# Altium schematic sheet featherULP.SchDoc
size 282 x 200 mm; COMPANY: ADAFRUIT INDUSTRIES; DRAWN: KTOWN; REV: B
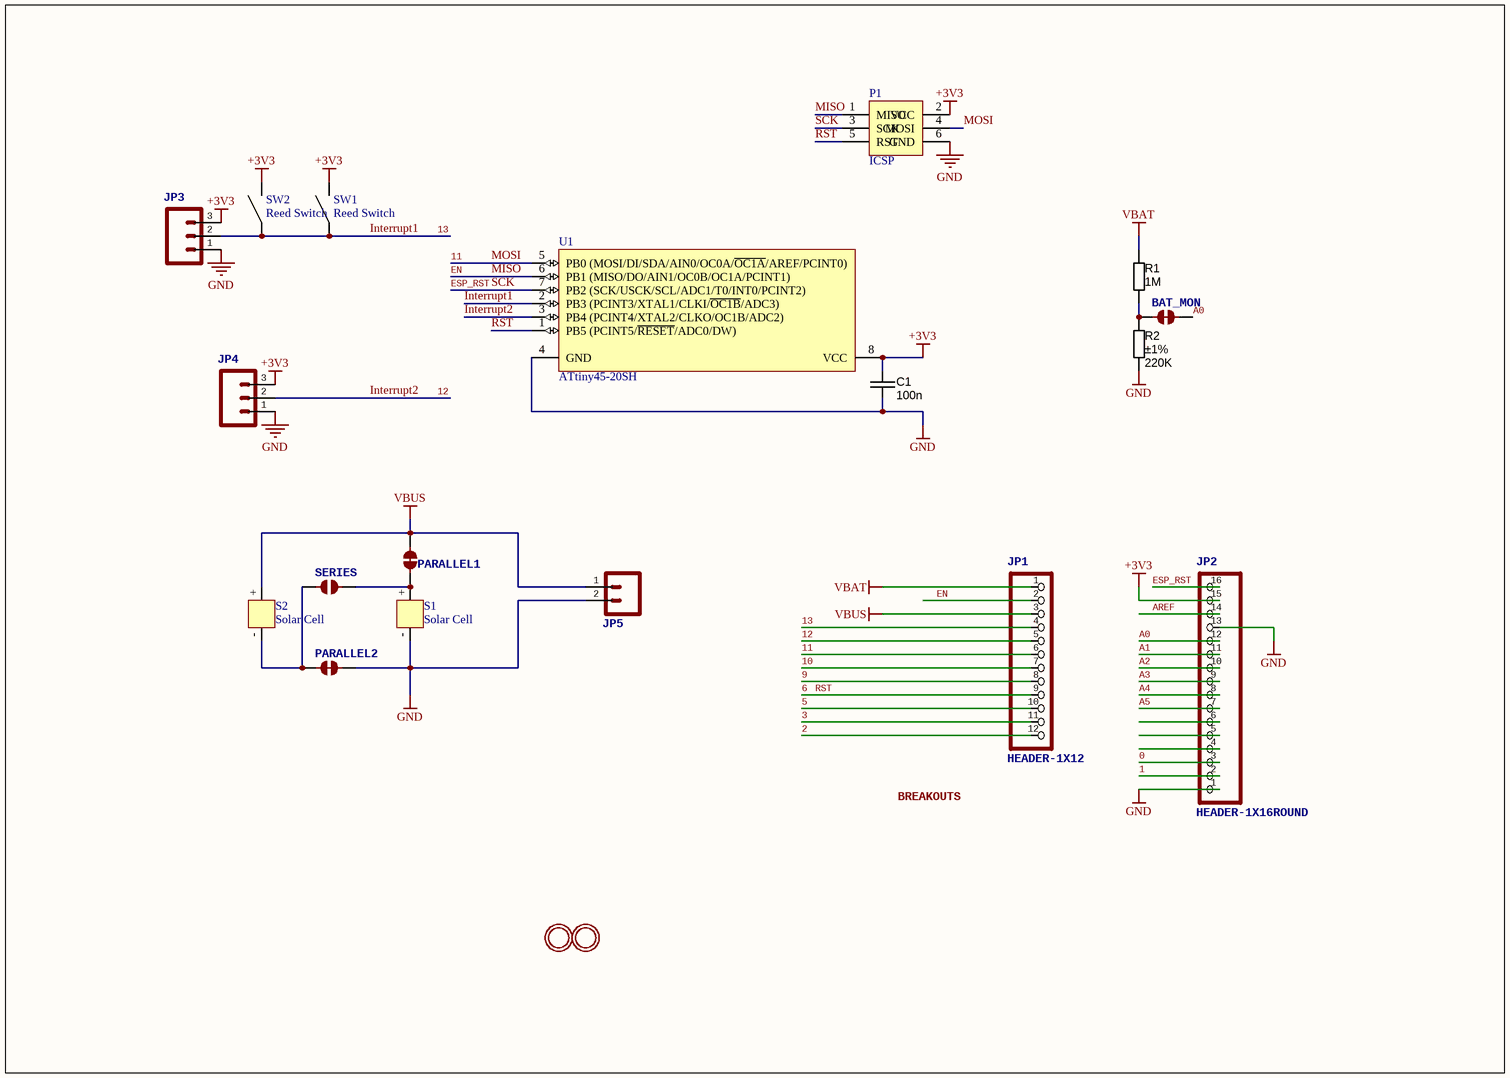
[diagram p0: featherULP.SchDoc]

## Parts
BAT_MON  JUMPER-PAD-2-NC_BY_TRACENO_SILK  [PAD-JUMPER-2-NC_BY_TRACE_NO_SILK]  (value not drawn)
C1  value 100n  [CAPC1608X90N]  (hidden comment: approved sub OK)
JP1  HEADER-1X12  [1X12_ROUND]
JP2  HEADER-1X16ROUND  [1X16_ROUND]
JP3  Header 3Standard 3-pin 0.1" header. Use with straight break away headers (SKU : PRT-00116), right angle break away headers (PRT-00553), swiss pins (PRT-00743), machine pins (PRT-00117), and female headers (PRT-00115). Molex polarized connector foot print use with SKU : PRT-08232 with associated crimp pins and housings.  [1X03]  (value not drawn)
JP4  Header 3Standard 3-pin 0.1" header. Use with straight break away headers (SKU : PRT-00116), right angle break away headers (PRT-00553), swiss pins (PRT-00743), machine pins (PRT-00117), and female headers (PRT-00115). Molex polarized connector foot print use with SKU : PRT-08232 with associated crimp pins and housings.  [1X03]  (value not drawn)
JP5  Standard 2-pin 0.1" header. Use with  - straight break away headers ( PRT-00116) - right angle break away headers (PRT-00553) - swiss pins (PRT-00743) - machine pins (PRT-00117) - female headers (PRT-00115)   Molex polarized connector foot print use with: PRT-08233 with associated crimp pins and housings.  2.54_SCREWTERM for use with  PRT-10571.  3.5mm Screw Terminal footprints for  PRT-08084  5mm Screw Terminal footprints for use with PRT-08432  [1X02]  (value not drawn)
P1  ICSP  [ICSP Pads - SMD]
PARALLEL1  JUMPER-PAD-2-NC_BY_TRACENO_SILK  [PAD-JUMPER-2-NC_BY_TRACE_NO_SILK]  (value not drawn)
PARALLEL2  JUMPER-PAD-2-NC_BY_TRACENO_SILK  [PAD-JUMPER-2-NC_BY_TRACE_NO_SILK]  (value not drawn)
R1  value 1M  [RESC2012X70N]  (hidden comment: Thick Film)
R2  value 220K  Tolerance: ±1%  [RESC2012X70N]  (hidden comment: Thick Film)
S1  Solar Cell  [Solar Cell IXYS  KXOB22-01X8L-ND]
S2  Solar Cell  [Solar Cell IXYS  KXOB22-01X8L-ND]
SERIES  JUMPER-PAD-2-NO  [PAD-JUMPER-2-NO_NO_SILK]  (value not drawn)
SW1  Reed Switch  [Reed Switch MDSM-4]
SW2  Reed Switch  [Reed Switch MDSM-4]
U1  ATtiny45-20SH  [8S2_N]
U$31  MOUNTINGHOLE2.5  [MOUNTINGHOLE_2.5_PLATED]  (value not drawn)
U$32  MOUNTINGHOLE2.5  [MOUNTINGHOLE_2.5_PLATED]  (value not drawn)

## Nets
+3V3: C1.1 JP2.15 JP3.3 JP4.3 P1.2(VCC) SW1.1 SW2.1 U1.8(VCC)
GND: C1.2 JP2.1 JP2.13 JP3.1 JP4.1 JP5.2 P1.6(GND) PARALLEL2.2 R2.2 S1.- U1.4(GND)
VBAT: JP1.1 R1.1
VBUS: JP1.3 JP5.1 PARALLEL1.2 S2.+
0: JP2.3
1: JP2.2
2: JP1.12
3: JP1.11
5: JP1.10
6: JP1.9 P1.5(RST) U1.1(PB5_(PCINT5/~{RESET}/ADC0/DW))  [also labelled RST]
9: JP1.8
10: JP1.7
11: JP1.6 P1.4(MOSI) U1.5(PB0_(MOSI/DI/SDA/AIN0/OC0A/~{OC1A}/AREF/PCINT0))  [also labelled MOSI]
12: JP1.5 JP4.2 U1.3(PB4_(PCINT4/XTAL2/CLKO/OC1B/ADC2))  [also labelled Interrupt2]
13: JP1.4 JP3.2 SW1.0 SW2.0 U1.2(PB3_(PCINT3/XTAL1/CLKI/~{OC1B}/ADC3))  [also labelled Interrupt1]
A0: BAT_MON.2 JP2.12
A1: JP2.11
A2: JP2.10
A3: JP2.9
A4: JP2.8
A5: JP2.7
AREF: JP2.14
EN: JP1.2 P1.1(MISO) U1.6(PB1_(MISO/DO/AIN1/OC0B/OC1A/PCINT1))  [also labelled MISO]
ESP_RST: JP2.16 P1.3(SCK) U1.7(PB2_(SCK/USCK/SCL/ADC1/T0/INT0/PCINT2))  [also labelled SCK]
NetBAT_MON_1: BAT_MON.1 R1.2 R2.1
NetPARALLEL1_1: PARALLEL1.1 S1.+ SERIES.2
NetPARALLEL2_1: PARALLEL2.1 S2.- SERIES.1

Not connected (* = marked no-connect by the designer): JP2 4 5 6

## Notes on the sheet
- BREAKOUTS

## Library data of the parts
C1 = CAPC_100n_0603_X7R_50V_10%: Capacitor SMD Cer 100nF 10% 50V X7R 0603; Manufacturer 1: AVX Corporation; Manufacturer Part Number 1: 06035C104KAT2A; Ratings: 50V; X7R; Material: ceramic; SCDType: spec; Manufacturer 2: TDK Corporation; Manufacturer Part Number 2: C1608X7R1H104K; Package / Case: 0603 (1608 Metric); Tolerance: ±10%; Supplier 1: Digi-Key; Supplier Part Number 1: 478-5052-1-ND; ComponentLink1URL: http://www.avx.com/docs/Catalogs/cx7r.pdf; ComponentLink1Description: http://www.avx.com/docs/Catalogs/cx7r.pdf; Supplier 2: Digi-Key; Supplier Part Number 2: 445-1314-1-ND; ComponentLink2URL: http://product.tdk.com/capacitor/mlcc/en/documents/mlcc_commercial_general_en.pdf; ComponentLink2Description: http://product.tdk.com/capacitor/mlcc/en/documents/mlcc_commercial_general_en.pdf
JP1 = HEADER-1X12: COMPANY: ADAFRUIT INDUSTRIES; DRAWN: KTOWN; REV: B
JP2 = HEADER-1X16ROUND: PIN HEADER; COMPANY: ADAFRUIT INDUSTRIES; DRAWN: KTOWN; REV: B
JP3 JP4 = M03PTH
JP5 = M02PTH
P1 = Header 3X2: Header, 3-Pin, Dual row; LatestRevisionDate: 17-Jul-2002; LatestRevisionNote: Re-released for DXP Platform.; Publisher: Altium Limited
R1 = RES_1M_0805_5%: Resistor SMD chip 1M Ohm 0.125W 5% 0805; Manufacturer 1: Vishay/Dale; Manufacturer Part Number 1: CRCW08051M00JNEA; Ratings: 1/8W; SCDType: spec; Tolerance: ±5%; Package / Case: 0805 (2012 metric); Supplier 1: Digi-Key; Supplier Part Number 1: 541-1.0MACT-ND
R2 = RES_205K_0805_1%: Resistor SMD chip 205k Ohm 0.125W 1% 0805; Manufacturer 1: Vishay/Dale; Manufacturer Part Number 1: CRCW0805205KFKEA; Ratings: 1/8W; SCDType: spec; Package / Case: 0805 (2012 metric); Supplier 1: Digi-Key; Supplier Part Number 1: 541-205KCCT-ND
U1 = ATtiny45-20SH: 8-bit AVR Microcontroller, 20MHz, 2.7-5.5V, 4K Flash, 256 Bytes EEPROM, 256 Bytes SRAM, Industrial Grade (-40°C to 85°C), 8-Lead SOIC, Pb-Free; DatasheetVersion: revN, Apr-2011; PackageVersion: revF, Apr-2008; PackageReference: 8S2; PackageDescription: 8-Lead, 0.208" Body, Plastic Small Outline Package (EIAJ); ComponentLink1Description: Manufacturer URL; ComponentLink1URL: http://www.atmel.com/; ComponentLink2Description: ATtiny25/45/85 Datasheet; ComponentLink2URL: http://www.atmel.com/dyn/resources/prod_documents/doc2586.pdf; ComponentLink3Description: ATtiny25/45/85 Summary; ComponentLink3URL: http://www.atmel.com/dyn/resources/prod_documents/2586S.pdf
U$31 U$32 = MOUNTINGHOLE2.5: Mounting Hole   For #2 screws (0.086"/2.18mm width, 0.094"/2.4mm hole) use 2.5mm; BOM: EXCLUDE; COMPANY: ADAFRUIT INDUSTRIES; DRAWN: KTOWN; REV: B
S1 S2 = Solar Cell: Supplier 1: Digi-Key; Supplier Part Number 1: KXOB22-01X8L-ND
SW1 SW2 = Reed Switch: Supplier 1: Digi-Key; Supplier Part Number 1: HE151CT-ND